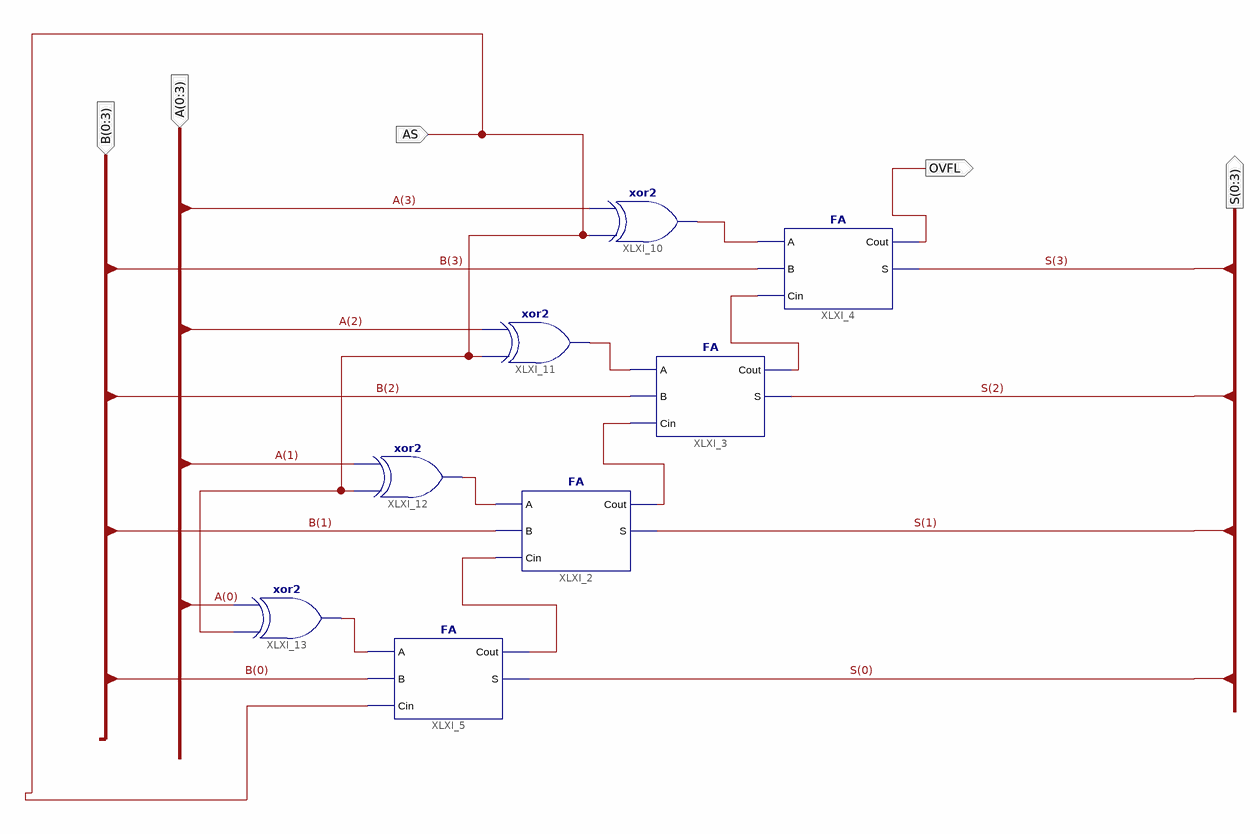
[diagram p0: schematic sheet 1]
// Xilinx ISE schematic RCA_4.sch (spartan3e) as structural Verilog: 8 symbols, 5 ports
module RCA_4 (
  input  [0:3] B,
  input  AS,
  input  [0:3] A,
  output OVFL,
  output [0:3] S
);

  wire XLXN_12, XLXN_13, XLXN_15, XLXN_33, XLXN_34, XLXN_35, XLXN_36;

  FA XLXI_2 (.A(XLXN_34), .B(B[1]), .Cin(XLXN_15), .Cout(XLXN_12), .S(S[1]));
  FA XLXI_3 (.A(XLXN_35), .B(B[2]), .Cin(XLXN_12), .Cout(XLXN_13), .S(S[2]));
  FA XLXI_4 (.A(XLXN_36), .B(B[3]), .Cin(XLXN_13), .Cout(OVFL), .S(S[3]));
  FA XLXI_5 (.A(XLXN_33), .B(B[0]), .Cin(AS), .Cout(XLXN_15), .S(S[0]));
  xor XLXI_10 (XLXN_36, AS, A[3]);
  xor XLXI_11 (XLXN_35, AS, A[2]);
  xor XLXI_12 (XLXN_34, AS, A[1]);
  xor XLXI_13 (XLXN_33, AS, A[0]);
endmodule
